# Altium schematic sheet PowerM.SchDoc
size A4; SheetNumber: 1; SheetTotal: 1
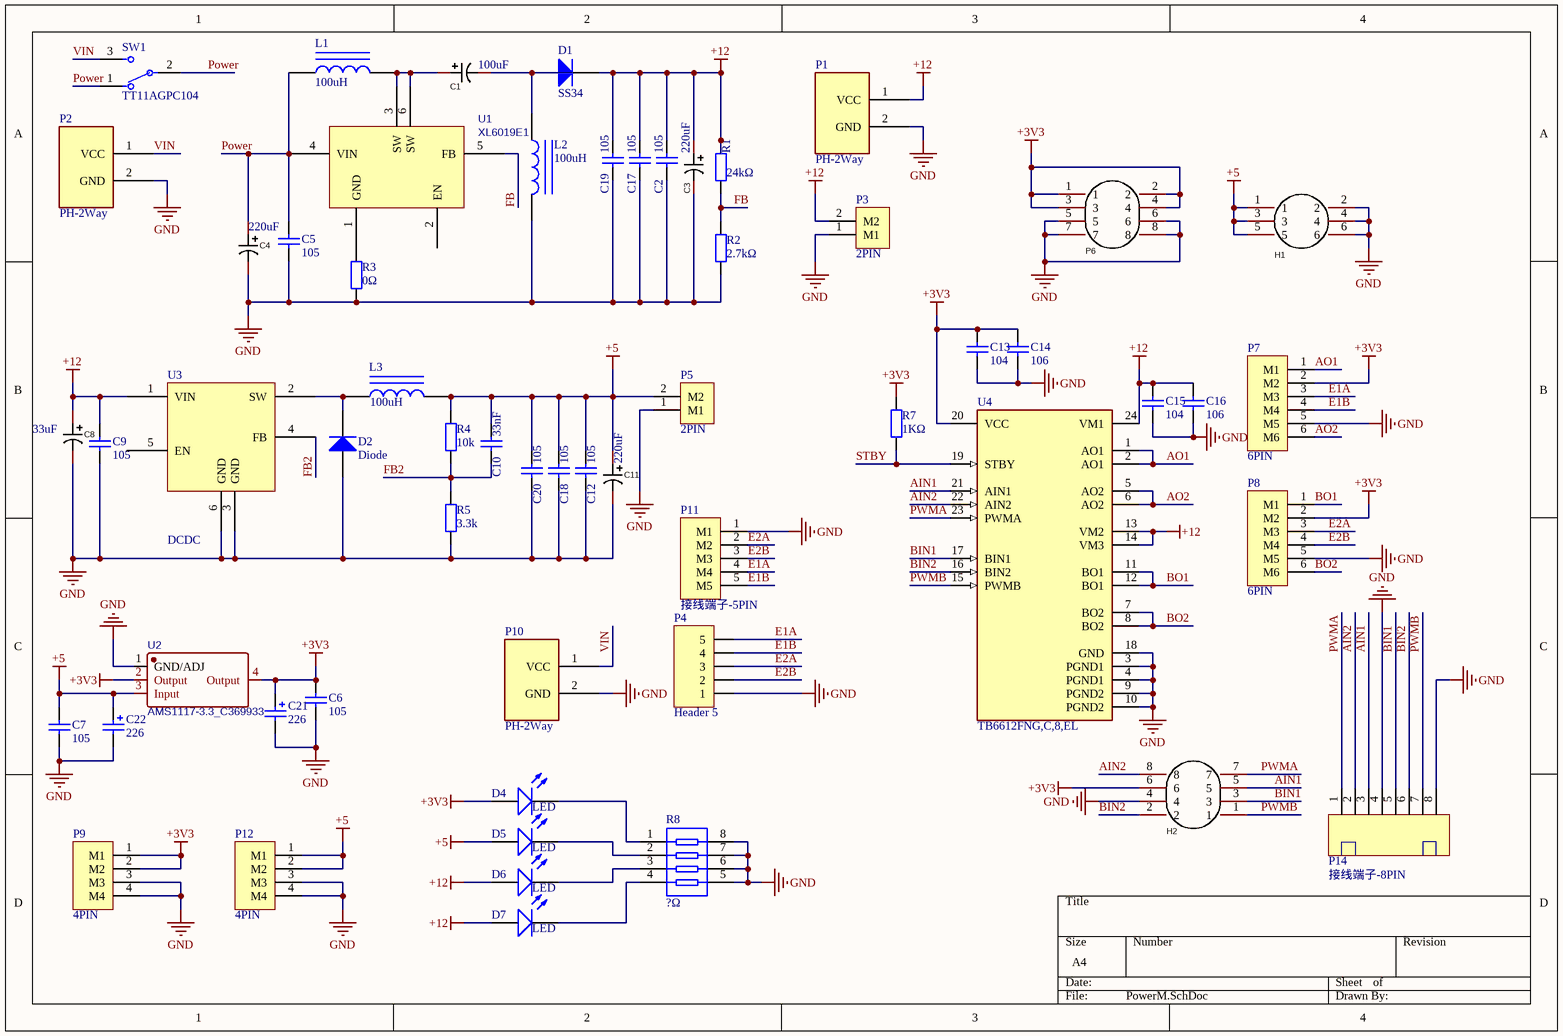
[diagram p0: PowerM.SchDoc]

## Parts
C1  100uF  [CAP 5.0*10*12.5]
C2  105  [0603_C]
C3  220uF  [CAP 5.0*10*12.5]
C4  220uF  [CAP 5.0*10*12.5-H]
C5  105  [0603_C]
C6  105  [0603_C]
C7  105  [0603_C]
C8  33uF  [CAP 5.0*10*12.5]
C9  105  [0603_C]
C10  33nF  [0603_C]
C11  220uF  [CAP 5.0*10*12.5-H - GD]
C12  105  [0603_C]
C13  104  [0603_C]
C14  106  [0603_C]
C15  104  [0603_C]
C16  106  [0603_C]
C17  105  [0603_C]
C18  105  [0603_C]
C19  105  [0603_C]
C20  105  [0603_C]
C21  226  [CASE-C_6032]
C22  226  [CASE-C_6032]
D1  SS34  [SMA(DO-214AC)_S2]
D2  Diode  [SMA(DO-214AC)_S2]
D4  LED  [0805_LED]
D5  LED  [0805_LED]
D6  LED  [0805_LED]
D7  LED  [0805_LED]
H1  PH6  [HDR-TH_6P-P2.54-V-M-R2-C3-S2.54-1]  (value not drawn)
H2  PH8  [HDR-TH_8P-P2.54-V-R2-C4-S2.54_A2541WV-2X4P]  (value not drawn)
L1  100uH  [CDRH127]
L2  100uH  [CDRH127]
L3  100uH  [CDRH127]
P1  PH-2Way  [XT30-M]
P2  PH-2Way  [XT30-M]
P3  2PIN  [KF128-2P]
P4  Header 5  [HDR2.54-WS-5P]
P5  2PIN  [KF128-2P]
P6  PH8  [HDR-TH_8P-P2.54-V-R2-C4-S2.54_A2541WV-2X4P]  (value not drawn)
P7  6PIN  [PH2.0WS-6P]
P8  6PIN  [PH2.0WS-6P]
P9  4PIN  [MX1.25WS-4PIN]
P10  PH-2Way  [XH2.54-WS-2P]
P11  接线端子-5PIN  [PH2.0-WS-5P]
P12  4PIN  [MX1.25WS-4PIN]
P14  接线端子-8PIN  [MX1.25WS-8P]
R1  24kΩ  [0603_R]
R2  2.7kΩ  [0603_R]
R3  0Ω  [1206_R]
R4  10k  [0603_R]
R5  3.3k  [0603_R]
R7  1KΩ  [0603_R]
R8  ?Ω  [0603_Rx4]
SW1  TT11AGPC104  [FP-TT11AGPC104-MFG]
U1  XL6019E1  [TO-263-5_L10.2-W9.9-P1.70-LS14.4-TL]
U2  AMS1117-3.3_C369933  [SOT-223-4_L6.5-W3.5-P2.30-LS7.0-BR]
U3  DCDC  [TO-252-XL]
U4  TB6612FNG,C,8,EL  [FP-SSOP24-P-300-0_65A-IPC_A]

## Nets
+3V3: C6.2 C13.2 C14.2 C21.1 D4.A H2.6 P6.1 P6.2 P6.3 P6.4 P7.2(M2) P8.2(M2) P9.1(M1) P9.2(M2) R7.2 U2.2(Output) U2.4(Output) U4.20(VCC)
+5: C7.2 C10.1 C11.1 C12.2 C18.2 C20.2 C22.1 D5.A H1.1 H1.3 H1.5 L3.2 P5.2(M2) P12.1(M1) P12.2(M2) R4.2 U2.3(Input)
+12: C2.2 C3.1 C8.1 C9.2 C15.2 C16.2 C17.2 C19.2 D1.2(K) D6.A D7.A P1.1(VCC) P3.2(M2) R1.2 U3.1(VIN) U4.13(VM2) U4.14(VM3) U4.24(VM1)
GND: C2.1 C3.2 C4.2 C5.1 C6.1 C7.1 C8.2 C9.1 C11.2 C12.1 C13.1 C14.1 C15.1 C16.1 C17.1 C18.1 C19.1 C20.1 C21.2 C22.2 D2.1(A) H1.2 H1.4 H1.6 H2.4 L2.2 P1.2(GND) P2.2(GND) P3.1(M1) P4.1 P5.1(M1) P6.5 P6.6 P6.7 P6.8 P7.5(M5) P8.5(M5) P9.3(M3) P9.4(M4) P10.2(GND) P11.1(M1) P12.3(M3) P12.4(M4) P14.4 P14.8 R2.1 R3.1 R5.1 R8.5 R8.6 R8.7 R8.8 U2.1(GND/ADJ) U3.3(GND) U3.6(GND) U4.3(PGND1) U4.4(PGND1) U4.9(PGND2) U4.10(PGND2) U4.18(GND)
AIN1: H2.5 P14.3 U4.21(AIN1)
AIN2: H2.8 P14.2 U4.22(AIN2)
AO1: P7.1(M1) U4.1(AO1) U4.2(AO1)
AO2: P7.6(M6) U4.5(AO2) U4.6(AO2)
BIN1: H2.3 P14.5 U4.17(BIN1)
BIN2: H2.2 P14.6 U4.16(BIN2)
BO1: P8.1(M1) U4.11(BO1) U4.12(BO1)
BO2: P8.6(M6) U4.7(BO2) U4.8(BO2)
E1A: P4.5 P7.3(M3) P11.4(M4)
E1B: P4.4 P7.4(M4) P11.5(M5)
E2A: P4.3 P8.3(M3) P11.2(M2)
E2B: P4.2 P8.4(M4) P11.3(M3)
FB: R1.1 R2.2 U1.5(FB)
FB2: C10.2 R4.1 R5.2 U3.4(FB)
Power: C4.1 C5.2 L1.1 SW1.1 SW1.2 U1.4(VIN)
PWMA: H2.7 P14.1 U4.23(PWMA)
PWMB: H2.1 P14.7 U4.15(PWMB)
STBY: R7.1 U4.19(STBY)
VIN: P2.1(VCC) P10.1(VCC) SW1.3
NetC1_1: C1.1 L1.2 U1.3(SW) U1.6(SW)
NetC1_2: C1.2 D1.1(A) L2.1
NetD2_2: D2.2(K) L3.1 U3.2(SW)
NetD4_K: D4.K R8.1
NetD5_K: D5.K R8.2
NetD6_K: D6.K R8.3
NetD7_K: D7.K R8.4
NetR3_2: R3.2 U1.1(GND)

Not connected (* = marked no-connect by the designer): U1 2(EN); U3 5(EN)

## Library data of the parts
C1 = TH_Cap: 插件电容; Manufacturer: MAN YUE(万裕科技); Symbol: ULR107M1CE08TUX0CR; Add into BOM: yes; Type: 聚合物; Tolerance: ±20%; Rated Voltage: 16V; φD: 6.3mm; L: 8mm; Lifetime @ Temp: 2000hrs@105℃; Name: 100uF; Device: ULR107M1CE08TUX0CR; LCSC Part Name: 100uF ±20% 16V; Supplier Part: C2923568; Manufacturer Part: ULR107M1CE08TUX0CR; Supplier Footprint: 径向引线,6.3x8mm; JLCPCB Part Class: Extended Part; Datasheet: https://atta.szlcsc.com/upload/public/pdf/source/20211118/585B9CEDE9E08D4A86043C401C7B1F80.pdf; Supplier: LCSC; Convert to PCB: yes; Value: 100uF; Lead Spacing: 2.5mm; Ripple Current: -; Equivalent Series Resistance(ESR): -; Operating Temperature: -55℃~+105℃
C2 C5-C7 C9 C10 C12-C20 = SMT_Cap: 贴片电容; ComponentLink1Description: 供应商链接; ComponentLink1URL: http://www.szlcsc.com/product/details_29010.html; Package: 0805; Supplier: LC; SuppliersPartNumber: C28260
C3 C4 C8 C11 = TH_Cap: 插件电容; Manufacturer: MAN YUE(万裕科技); Name: 100uF; Symbol: ULR107M1CE08TUX0CR; Add into BOM: yes; Type: 聚合物; Value: 100uF; Tolerance: ±20%; Rated Voltage: 16V; φD: 6.3mm; L: 8mm; Lifetime @ Temp: 2000hrs@105℃; Device: ULR107M1CE08TUX0CR; LCSC Part Name: 100uF ±20% 16V; Supplier Part: C2923568; Manufacturer Part: ULR107M1CE08TUX0CR; Supplier Footprint: 径向引线,6.3x8mm; JLCPCB Part Class: Extended Part; Datasheet: https://atta.szlcsc.com/upload/public/pdf/source/20211118/585B9CEDE9E08D4A86043C401C7B1F80.pdf; Supplier: LCSC; Convert to PCB: yes; Lead Spacing: 2.5mm; Ripple Current: -; Equivalent Series Resistance(ESR): -; Operating Temperature: -55℃~+105℃
C21 C22 = SMT_Cap_Tantalum: 钽电容; ComponentLink1Description: 供应商链接; ComponentLink1URL: http://www.szlcsc.com/product/details_16815.html; Package: 3528; Supplier: LC; SuppliersPartNumber: C16133
D1 D2 = Diode: 通用二极管; ComponentLink1Description: 供应商链接; ComponentLink1URL: http://www.szlcsc.com/product/details_9093.html; Package: SOD-123; Supplier: LC; SuppliersPartNumber: C8598
D4-D7 = LED: 发光二极管; ComponentLink1Description: 供应商链接; ComponentLink1URL: http://www.szlcsc.com/product/details_2663.html; Package: 0603; Supplier: LC; SuppliersPartNumber: C2290
H1 = PH-6Way-2Row: Manufacturer: CJT(长江连接器); Symbol: A2541WV-2X3P; Add into BOM: yes; Pitch: 2.54mm; Pin Structure: 2x3P; Circluar Pins/Square Pins: 方针; Device: A2541WV-2x3P; LCSC Part Name: 2.54mm 2x3P 直插 方针; Supplier Part: C225518; Manufacturer Part: A2541WV-2x3P; Supplier Footprint: 直插,P=2.54mm; JLCPCB Part Class: Extended Part; Datasheet: https://atta.szlcsc.com/upload/public/pdf/source/20180509/C225518_0BFA6BCCBDAB2EC993D26ADC2A9ADF8C.pdf; Supplier: LCSC; Convert to PCB: yes; Number of Pins: 6; Number of Rows: 2; Row Spacing: 2.54mm; Mounting Type: 直插; Current Rating (Max): -; Voltage Rating (Max): -; Length of Mating Pin: 6mm; Insulation Height: 2.54mm; Length of End Connection Pin: 3mm; Contact Material: 黄铜; Contact Plating: -; Operating Temperature Range: -40℃~+105℃; Color: 黑色
H2 P6 = PH-8Way-2Row: Manufacturer: CJT(长江连接器); Symbol: A2541WV-2X4P; Add into BOM: yes; Pitch: 2.54mm; Pin Structure: 2x4P; Circluar Pins/Square Pins: 方针; Device: A2541WV-2x4P; LCSC Part Name: 2.54mm 2x4P 直插 方针 镀金; Supplier Part: C225519; Manufacturer Part: A2541WV-2x4P; Supplier Footprint: 插件,P=2.54mm; JLCPCB Part Class: Extended Part; Datasheet: https://atta.szlcsc.com/upload/public/pdf/source/20180509/C225519_93746B99266AA550760B05B3359A404E.pdf; Supplier: LCSC; Convert to PCB: yes; Number of Pins: 8; Number of Rows: 2; Row Spacing: 2.54mm; Mounting Type: 直插; Current Rating (Max): -; Voltage Rating (Max): -; Length of Mating Pin: 6mm; Insulation Height: 2.54mm; Length of End Connection Pin: 3mm; Contact Material: 黄铜; Contact Plating: -; Operating Temperature Range: -40℃~+105℃; Color: 黑色
L1-L3 = SMT_Iud_Power: 功率电感; ComponentLink1Description: 供应商链接; ComponentLink1URL: http://www.szlcsc.com/product/details_30010.html; Package: 0603; Supplier: LC; SuppliersPartNumber: C29258
P3 P5 = 接线端子-2PIN
P4 = Header 5: 排针
P7 P8 = 接线端子-6PIN
P9 P12 = 接线端子-4PIN
R1-R5 R7 = SMT_Res: 贴片电阻; ComponentLink1Description: 供应商链接; ComponentLink1URL: http://www.szlcsc.com/product/details_23980.html; Package: 0603; Supplier: LC; SuppliersPartNumber: C23253
R8 = SMT_Res-4: 贴片排阻; ComponentLink1Description: 供应商链接; ComponentLink1URL: http://www.szlcsc.com/product/details_26253.html; Package: 0603*4; Supplier: LC; SuppliersPartNumber: C25510
SW1 = CMP-03408-000020-1: SWITCH TOGGLE SPST 0.4VA 20V; Illumination Type: Illuminated; Actuator Length: 5.61mm; Contact Current Rating: 3A; Power Rating: 400mW; Voltage Rating (AC): 20V; Packaging: Bulk; Max Voltage Rating (DC): 20V; Actuator Type: Toggle; Orientation: Straight; RoHS Compliant: Yes; Throw Configuration: SPST; Min Operating Temperature: -30°C; Voltage Rating (DC): 20V; Series: TT (Tiny); Contact Plating: Gold; Package Quantity: 25; Max Operating Temperature: 85°C; Mount: Brackets; Termination: PC Pins; Max Voltage Rating (AC): 20V
U1 = XL6019E1: 宽输入DCDC升降压管理芯片; BOM_Manufacturer: XLSEMI; BOM_Supplier: LCSC; BOM_Manufacturer Part: XL6019E1; BOM_Supplier Part: C73018; BOM_JLCPCB Part Class: Extended Part; spicePre: U; spiceSymbolName: XL6019E1
U2 = AMS1117-3.3_C369933: BOM_Manufacturer: KEXIN; Contributor: LCSC; BOM_Supplier: LCSC; BOM_Supplier Part: C369933; BOM_Manufacturer Part: AMS1117-3.3; BOM_JLCPCB Part Class: Extended Part; spicePre: U; spiceSymbolName: AMS1117-3.3_C369933
U3 = XL7015: 宽输入DCDC升降压管理芯片（Buck）
U4 = CMP-2100-03693-4: IC MOTOR DRIVER 2.7V-5.5V 24SSOP; Logic Function: AND GATE; Interface: Parallel; Operating Supply Voltage: 3V; Max Supply Voltage: 5.5V; Output Current: 1A; Min Supply Voltage: 2.7V; Number of Outputs: 2; Packaging: Tape and Reel; Mount: Surface Mount; Number of Pins: 24; Min Operating Temperature: -20°C; Case/Package: SSOP; Series: -; Max Operating Temperature: 85°C; Package Quantity: 1